# Altium project ESP_4relays.PrjPCB
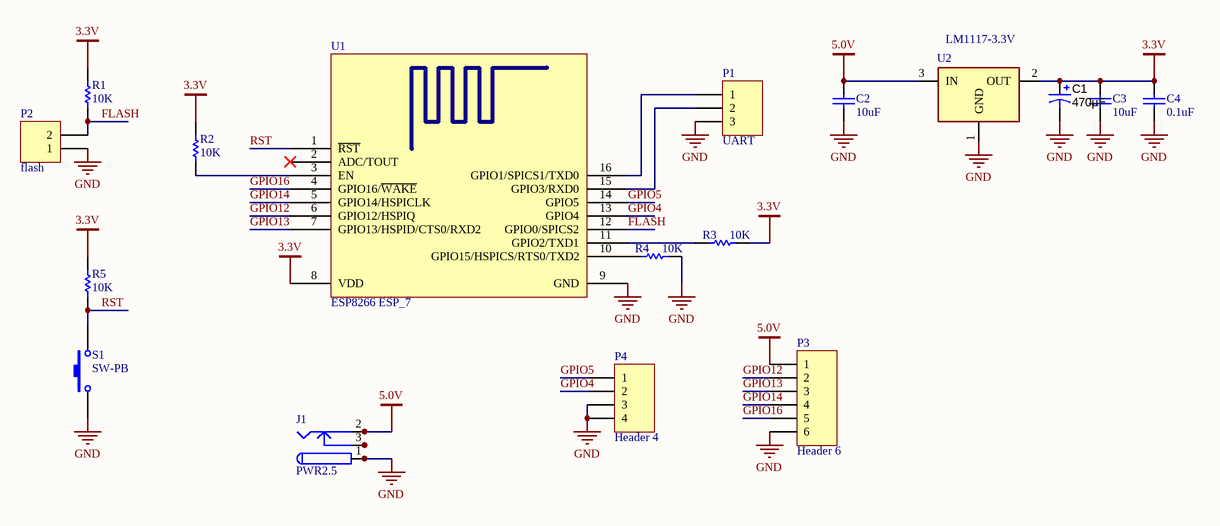
[diagram p0: Schematic.SchDoc]
1 sheet, 17 parts. Net scope: global (net labels, ports and power ports of the same name join across sheets).
Board file: PCB1.PcbDoc

## Sheet Schematic.SchDoc
size A

### Parts
C1  ValueDisplayed: 470µF  [7260-38]  (hidden comment: T495E477K010ATE040)
C2  value 10uF  [C1206]  (hidden comment: Cap Semi)
C3  value 10uF  [C1206]  (hidden comment: Cap Semi)
C4  value 0.1uF  [C1206]  (hidden comment: Cap Semi)
J1  PWR2.5  [Jack-DC]
P1  UART  [HDR1X3]
P2  flash  [HDR1X2]
P3  Header 6  [HDR1X6]
P4  Header 4  [HDR1X4]
R1  value 10K  [6-0805_N]  (hidden comment: Res1)
R2  value 10K  [6-0805_N]  (hidden comment: Res1)
R3  value 10K  [6-0805_N]  (hidden comment: Res1)
R4  value 10K  [6-0805_N]  (hidden comment: Res1)
R5  value 10K  [6-0805_N]  (hidden comment: Res1)
S1  SW-PB  [SW-SMD]
U1  ESP8266 ESP_7  [ESP8266 ESP_12]
U2  LM1117-3.3V  [SOT223-4N]

### Nets
3.3V: C1.1(+) C3.2 C4.2 R1.2 R2.2 R3.1 R5.2 U1.8(VDD) U2.2(OUT)
5.0V: C2.2 J1.2 J1.2A J1.2B P3.1 U2.3(IN)
GND: C1.2(-) C2.1 C3.1 C4.1 J1.1 J1.1A J1.1B P1.3 P2.1 P3.6 P4.3 P4.4 R4.1 S1.1 U1.9(GND) U2.1(GND)
FLASH: P2.2 R1.1 U1.12(GPIO0/SPICS2)
GPIO4: P4.2 U1.13(GPIO4)
GPIO5: P4.1 U1.14(GPIO5)
GPIO12: P3.2 U1.6(GPIO12/HSPIQ)
GPIO13: P3.3 U1.7(GPIO13/HSPID/CTS0/RXD2)
GPIO14: P3.4 U1.5(GPIO14/HSPICLK)
GPIO16: P3.5 U1.4(GPIO16/~{WAKE})
RST: R5.1 S1.2 U1.1(~{RST})
NetJ1_3: J1.3 J1.3A J1.3B
NetP1_1: P1.1 U1.16(GPIO1/SPICS1/TXD0)
NetP1_2: P1.2 U1.15(GPIO3/RXD0)
NetR2_1: R2.1 U1.3(EN)
NetR3_2: R3.2 U1.11(GPIO2/TXD1)
NetR4_2: R4.2 U1.10(GPIO15/HSPICS/RTS0/TXD2)

Not connected (* = marked no-connect by the designer): U1 2(ADC/TOUT)*

### Library data of the parts
C1 = T495E477K010ATE040: CAP, TANT, 470uF, 10V, +/-10%, 0.04 ohm, 7260-38 SMD; Manufacturer: Kemet; Polarized: Y; CompType: Capacitor; U/M: EA; Cap_F: 0.00047; Tolerance_%: 10; ESR_Ohm: 0.04; IRMS_A: 2.012; TaMin_C: -55; TaMax_C: 125; Cap_Case: E; SymbolVersion: 2008-07-09; Value: 470uF; PartNumber: T495E477K010ATE040; PackageReference: 7260-38; RoHS: Y; Value1: 0.04 ohm; VDC_V: 10; Value2: 10V; MountType: SMT; Technology: TA; Series: T495; Published: 2008-06-19; Publisher: Texas Instruments; LatestRevisionDate: 2012-08-28; LatestRevisionNote: Changed Publisher; ComponentLink1Description: Datasheet link; ComponentLink1URL: http://www.kemet.com/kemet/web/homepage/kechome.nsf/file/T495%20Series/$file/F3102_T495.pdf; Alternate PartNumber: -; Alternate Manufacturer: -; Supplier 1: Digi-Key; Supplier Part Number 1: 399-5127-1-ND; Supplier 2: Arrow; Supplier Part Number 2: T495E477K010ATE040
C2-C4 = Cap Semi: Capacitor (Semiconductor SIM Model); Published: 8-Jun-2000; LatestRevisionDate: 29-May-2009; LatestRevisionNote: IPC-7351 Footprint Added.; PackageReference: C1206; Publisher: Altium Limited; PackageDescription: Chip Capacitor
J1 = PWR2.5: Low Voltage Power Supply Connector; Published: 17-Dec-2003; DatasheetDocument: 09-May-2002; Publisher: Altium Limited; ComponentLink1Description: Manufacturer Link; ComponentLink1URL: http://domino.kycon.com/internet/Products.html
P1 = Header 3: Header, 3-Pin; LatestRevisionDate: 17-Jul-2002; LatestRevisionNote: Re-released for DXP Platform.; Publisher: Altium Limited
P2 = Header 2: Header, 2-Pin; LatestRevisionDate: 17-Jul-2002; LatestRevisionNote: Re-released for DXP Platform.; Publisher: Altium Limited
P3 = Header 6: Header, 6-Pin; LatestRevisionDate: 17-Jul-2002; LatestRevisionNote: Re-released for DXP Platform.; Publisher: Altium Limited
P4 = Header 4: Header, 4-Pin; LatestRevisionDate: 17-Jul-2002; LatestRevisionNote: Re-released for DXP Platform.; Publisher: Altium Limited
R1-R5 = Res1: Resistor; Published: 8-Jun-2000; LatestRevisionDate: 17-Jul-2002; LatestRevisionNote: Re-released for DXP Platform.; PackageReference: AXIAL-0.3; Publisher: Altium Limited; PackageDescription: Axial Device, Thru-Hole; 2 Leads; 0.3 in Pin Spacing
S1 = SW-PB: Switch; Published: 24-Mar-1999; LatestRevisionDate: 17-Jul-2002; LatestRevisionNote: Re-released for DXP Platform.; PackageReference: SPST-2; Publisher: Altium Limited; PackageDescription: Switch; 2 Leads
U1 = ESP8266 ESP_12: ESP8266 ESP-12; IC: ESP8266-EX; Vendor: Ai-thinker; LatestReviewer: Zion Blue; Published: 14-Apr-2015; Publisher: Cynetik Group; LatestRevisionData: 14-Apr-2015; LatestRevisionNote: Include 3D body and Footprint
U2 = LM1117: 800mA Low-Dropout Linear Regulator; Creator: Nguyen Ba Bien; Website: http://group3i.net